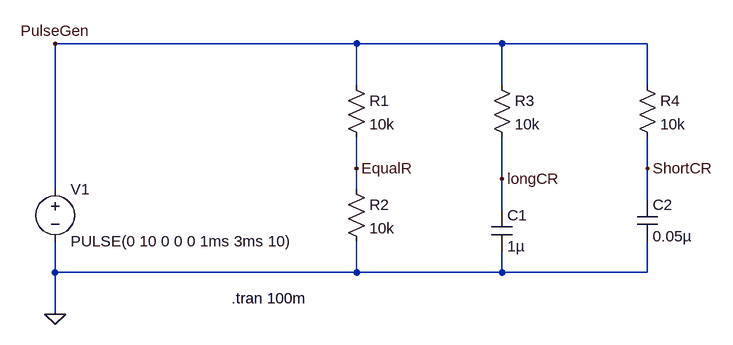
[diagram p0: schematic NV_SPICE_13.asc]
NV_SPICE_13.asc, the LTspice schematic file:
Version 4
SHEET 1 892 680
WIRE 352 -96 -112 -96
WIRE 576 -96 352 -96
WIRE 800 -96 576 -96
WIRE 352 -32 352 -96
WIRE 576 -32 576 -96
WIRE 800 -32 800 -96
WIRE 352 96 352 48
WIRE 800 96 800 48
WIRE 576 112 576 48
WIRE -112 128 -112 -96
WIRE 352 128 352 96
WIRE 800 144 800 96
WIRE 576 160 576 112
WIRE -112 256 -112 208
WIRE 352 256 352 208
WIRE 352 256 -112 256
WIRE 576 256 576 224
WIRE 576 256 352 256
WIRE 800 256 800 208
WIRE 800 256 576 256
WIRE -112 320 -112 256
FLAG -112 320 0
FLAG -112 -96 PulseGen
FLAG 576 112 longCR
FLAG 800 96 ShortCR
FLAG 352 96 EqualR
SYMBOL voltage -112 112 R0
WINDOW 123 0 0 Left 0
WINDOW 39 0 0 Left 0
SYMATTR InstName V1
SYMATTR Value PULSE(0 10 0 0 0 1ms 3ms 10)
SYMBOL cap 560 160 R0
SYMATTR InstName C1
SYMATTR Value 1µ
SYMBOL cap 784 144 R0
SYMATTR InstName C2
SYMATTR Value 0.05µ
SYMBOL res 336 -48 R0
SYMATTR InstName R1
SYMATTR Value 10k
SYMBOL res 336 112 R0
SYMATTR InstName R2
SYMATTR Value 10k
SYMBOL res 560 -48 R0
SYMATTR InstName R3
SYMATTR Value 10k
SYMBOL res 784 -48 R0
SYMATTR InstName R4
SYMATTR Value 10k
TEXT 160 296 Left 0 !.tran 100m

The netlist it stands for:
* NV_SPICE_13.asc
V1 PulseGen 0 PULSE(0 10 0 0 0 1ms 3ms 10)
C1 longCR 0 1µ
C2 ShortCR 0 0.05µ
R1 PulseGen EqualR 10k
R2 EqualR 0 10k
R3 PulseGen longCR 10k
R4 PulseGen ShortCR 10k
.tran 100m
.backanno
.end